# EAGLE schematic motobone2 (EAGLE 6.4)
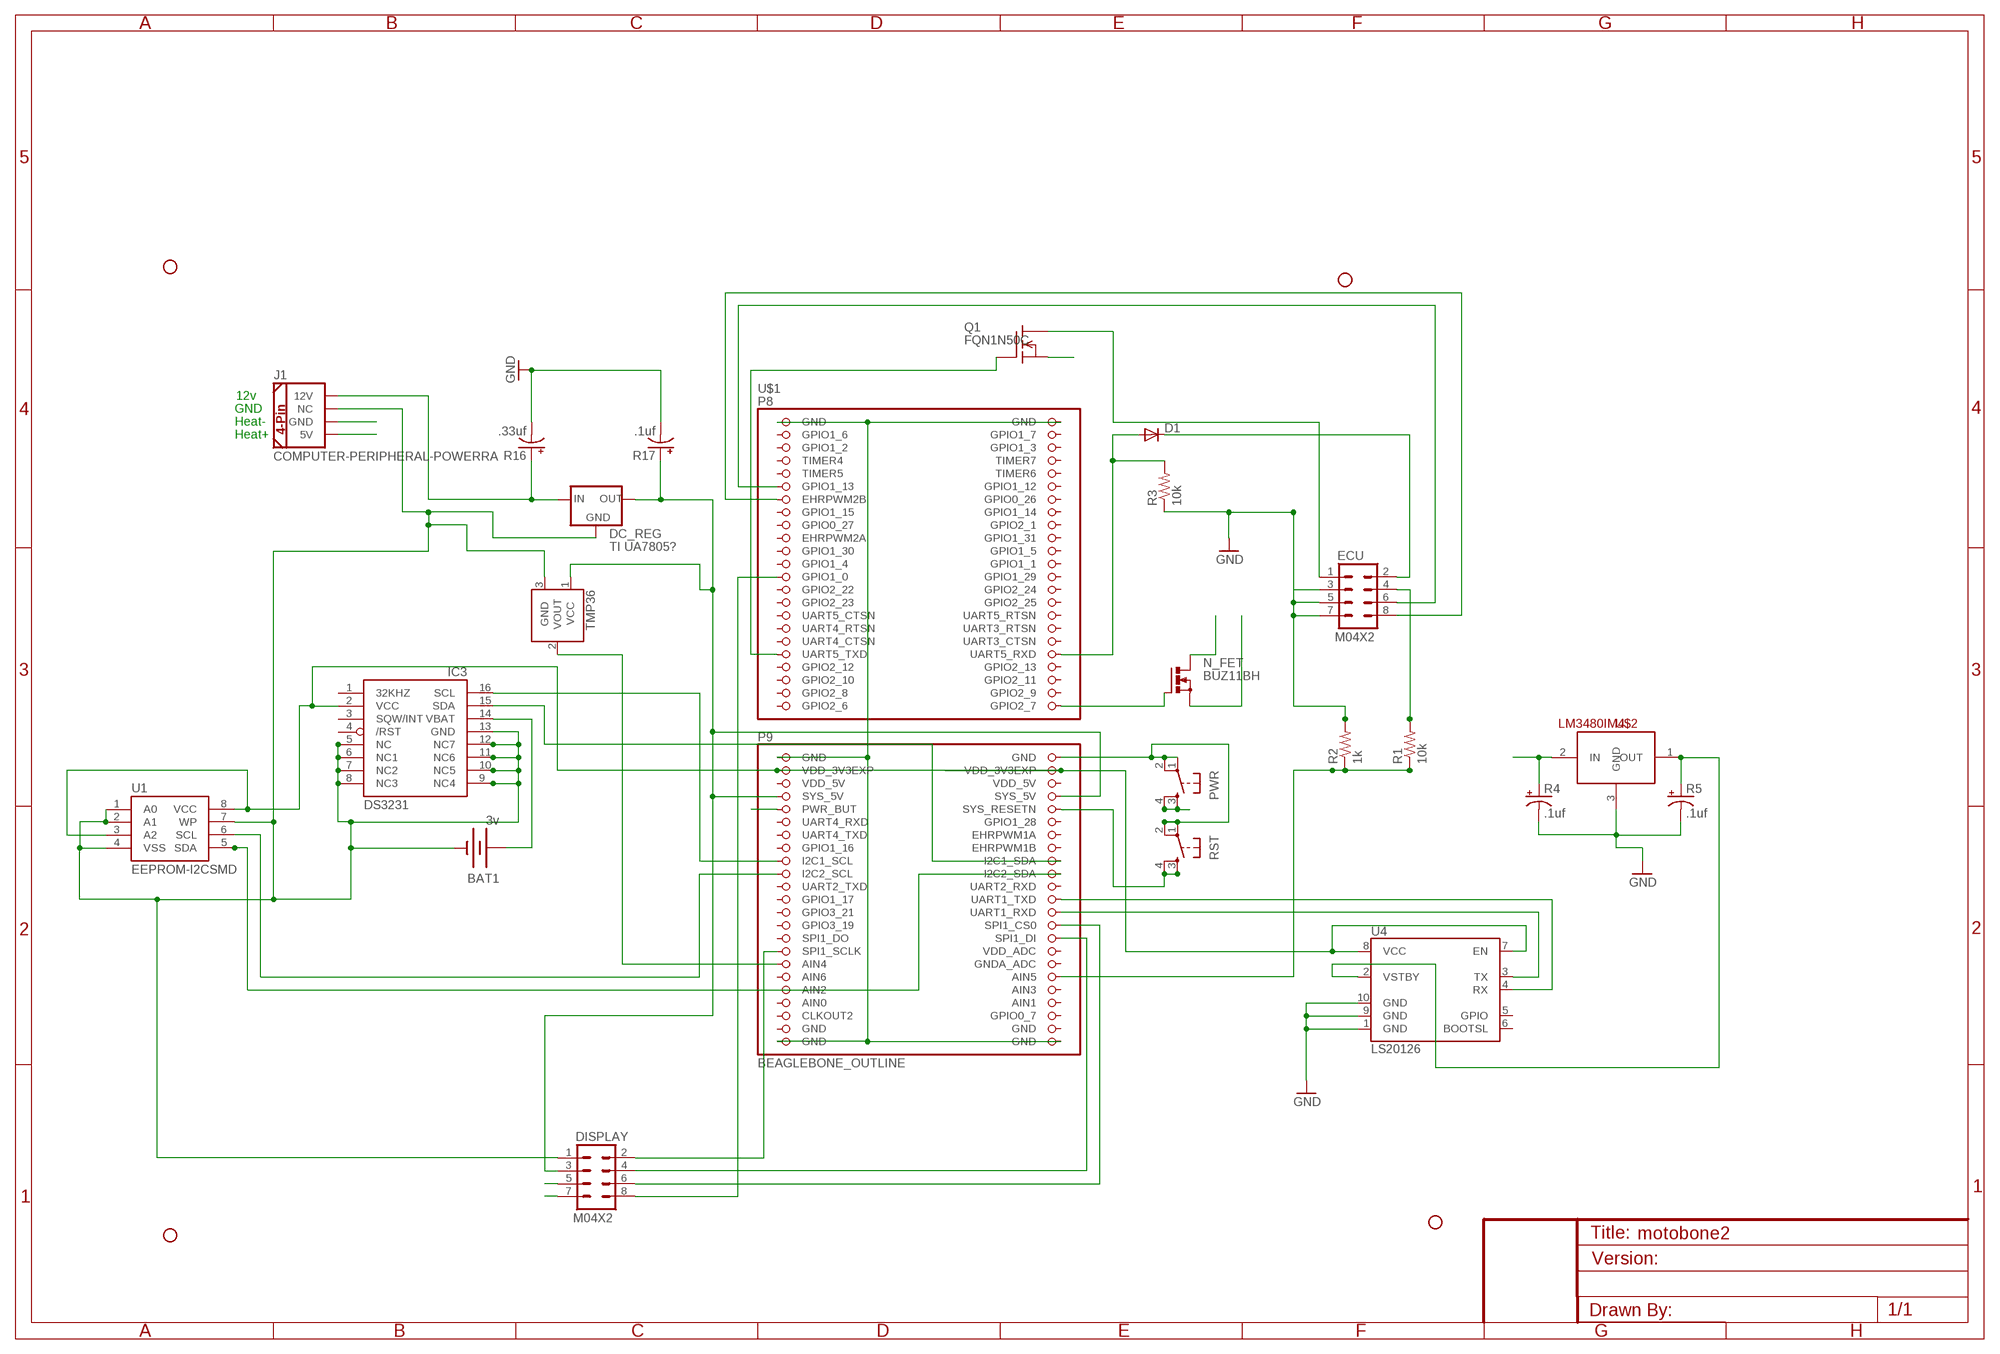
[diagram p0: schematic, sheet 1]

## Parts
BAT1  3v  BATTERY12PTH  [BATTCON_12MM_PTH]
D1  DIODE1N4148  [DIODE-1N4148]
DC_REG  TI UA7805?  V_REG_78XXSIDE  [78XXL]
DISPLAY  M04X2  [2X4]
ECU  M04X2  [2X4]
IC3  DS3231/SO  [SO16W]
J1  COMPUTER-PERIPHERAL-POWERRA  [COMPUTER-PERIPHERAL-POWER-RA]
N_FET  BUZ11BH  [TO220BH]
PWR  TAC_SWITCHPTH  [TACTILE-PTH]
Q1  FQN1N50C  [TO92]
R1  10k  RESISTOR1206  [1206]
R2  1k  RESISTOR1206  [1206]
R3  10k  RESISTOR1206  [1206]
R4  .1uf  10UF-TANT  [EIA3216]
R5  .1uf  10UF-TANT  [EIA3216]
R16  .33uf  10UF-TANT  [EIA3216]
R17  .1uf  10UF-TANT  [EIA3216]
RST  TAC_SWITCHPTH  [TACTILE-PTH]
STANDOFF1  STAND-OFF  [STAND-OFF]
STANDOFF2  STAND-OFF  [STAND-OFF]
STANDOFF3  STAND-OFF  [STAND-OFF]
STANDOFF4  STAND-OFF  [STAND-OFF]
TMP36  TMP36GT9  [TO-92]
U1  EEPROM-I2CSMD  [SO08]
U4  LS20126  [LS20126]
U$1  BEAGLEBONE_OUTLINE  [BEAGLEBONE_SHIELD]
U$2  LM3480IM4  [SOT23-3]

## Nets
12V [12v_power]: DC_REG.IN J1.12V R4.A(+) R16.A(+) U$2.2(IN)
12V_ECU: ECU.4 R1.2
GND [GND]: BAT1.GND(-) DC_REG.GND DISPLAY.1 ECU.3 ECU.5 ECU.7 IC3.5(NC) IC3.6(NC1) IC3.7(NC2) IC3.8(NC3) IC3.9(NC4) IC3.10(NC5) IC3.11(NC6) IC3.12(NC7) IC3.13(GND) J1.NC PWR.1 PWR.2 R2.2 R3.1 R4.C(-) R5.C(-) R16.C(-) R17.C(-) RST.1 RST.2 TMP36.3(GND) U1.1(A0) U1.2(A1) U1.4(VSS) U1.7(WP) U4.1(GND) U4.9(GND) U4.10(GND) U$1.1(GND) U$1.2(GND) U$1.47(GND) U$1.48(GND) U$1.91(GND) U$1.92(GND) U$2.3(GND)
HEAT+ [Heat]: J1.5V N_FET.S
HEAT- [Heat]: J1.GND N_FET.D
HEAT_GPIO: N_FET.G U$1.46(GPIO2_7)
N$1: DISPLAY.4 U$1.76(SPI1_DI)
N$2: IC3.16(SCL) U$1.63(I2C1_SCL)
N$3: DISPLAY.2 U$1.77(SPI1_SCLK)
N$4: TMP36.2(VOUT) U$1.79(AIN4)
N$5: BAT1.VCC@1(+) IC3.14(VBAT)
N$6: R5.A(+) U4.2(VSTBY) U$2.1(OUT)
N$7: IC3.15(SDA) U$1.64(I2C1_SDA)
N$9: U1.6(SCL) U$1.65(I2C2_SCL)
N$10: U1.5(SDA) U$1.66(I2C2_SDA)
N$11: DISPLAY.6 U$1.74(SPI1_CS0)
N$12: Q1.1(G) U$1.37(UART5_TXD)
N$13: ECU.6 U$1.11(GPIO1_13)
N$14: ECU.8 U$1.13(EHRPWM2B)
N$16: U4.3(TX) U$1.72(UART1_RXD)
N$17: R1.1 R2.1 U$1.82(AIN5)
N$18: U4.4(RX) U$1.70(UART1_TXD)
N$22: DISPLAY.8 U$1.25(GPIO1_0)
N$24: D1.C ECU.2
N$25: D1.A R3.2 U$1.38(UART5_RXD)
N$26: ECU.1 Q1.2(D)
PWR_BTN: DISPLAY.7 PWR.3 PWR.4 U$1.55(PWR_BUT)
RST_BTN: DISPLAY.5 RST.3 RST.4 U$1.56(SYS_RESETN)
SYS_5V [5v_power]: DC_REG.OUT DISPLAY.3 Q1.3(S) R17.A(+) TMP36.1(VCC) U$1.53(SYS_5V) U$1.54(SYS_5V)
VDD_3V3: IC3.2(VCC) U1.3(A2) U1.8(VCC) U4.7(EN) U4.8(VCC) U$1.49(VDD_3V3EXP) U$1.50(VDD_3V3EXP)
Unconnected: IC3.1(32KHZ) IC3.3(SQW/INT) IC3.4(/RST) U4.5(GPIO) U4.6(BOOTSL) U$1.3(GPIO1_6) U$1.4(GPIO1_7) U$1.5(GPIO1_2) U$1.6(GPIO1_3) U$1.7(TIMER4) U$1.8(TIMER7) U$1.9(TIMER5) U$1.10(TIMER6) U$1.12(GPIO1_12) U$1.14(GPIO0_26) U$1.15(GPIO1_15) U$1.16(GPIO1_14) U$1.17(GPIO0_27) U$1.18(GPIO2_1) U$1.19(EHRPWM2A) U$1.20(GPIO1_31) U$1.21(GPIO1_30) U$1.22(GPIO1_5) U$1.23(GPIO1_4) U$1.24(GPIO1_1) U$1.26(GPIO1_29) U$1.27(GPIO2_22) U$1.28(GPIO2_24) U$1.29(GPIO2_23) U$1.30(GPIO2_25) U$1.31(UART5_CTSN) U$1.32(UART5_RTSN) U$1.33(UART4_RTSN) U$1.34(UART3_RTSN) U$1.35(UART4_CTSN) U$1.36(UART3_CTSN) U$1.39(GPIO2_12) U$1.40(GPIO2_13) U$1.41(GPIO2_10) U$1.42(GPIO2_11) U$1.43(GPIO2_8) U$1.44(GPIO2_9) U$1.45(GPIO2_6) U$1.57(UART4_RXD) U$1.58(GPIO1_28) U$1.59(UART4_TXD) U$1.60(EHRPWM1A) U$1.61(GPIO1_16) U$1.62(EHRPWM1B) U$1.67(UART2_TXD) U$1.68(UART2_RXD) U$1.69(GPIO1_17) U$1.71(GPIO3_21) U$1.73(GPIO3_19) U$1.75(SPI1_DO) U$1.78(VDD_ADC) U$1.80(GNDA_ADC) U$1.81(AIN6) U$1.83(AIN2) U$1.84(AIN3) U$1.86(AIN1) U$1.87(CLKOUT2) U$1.88(GPIO0_7)

## Notes on the sheet
- 12v
- GND
- Heat-
- Heat+

## Power pins joined to a net without a drawn wire
AIN0: U$1.85(AIN0)
GND: U$1.89(GND) U$1.90(GND)
VDD_5V: U$1.51(VDD_5V) U$1.52(VDD_5V)

## Library data of the parts
BAT1 = SparkFun-Electromechanical:BATTERY: Battery Holders Various common sizes : AA, AAA, 20mm coin cell and 12mm coin cell. 20MM_4LEGS, BATT-10373
D1 = SparkFun-DiscreteSemi:DIODE: Diode These are standard reverse protection diodes and small signal diodes. SMA package can handle up to about 1A. SOD-323 can handle about 200mA. What the SOD-323 package when ordering, there are some mfgs out there that are 5-pin packages.
DC_REG = SparkFun-PowerIC:V_REG_78XX: Voltage Regulator Standard 7805 5V regulator. IGO (Input Ground Output). Spark Fun Electronics SKU : COM-00107
DISPLAY ECU = SparkFun-Connectors:M04X2: .1" header, two rows of four.
IC3 = adafruit:DS3231
J1 = SparkFun-Connectors:COMPUTER-PERIPHERAL-POWER
N_FET = transistor-power:BUZ11: N-CHANNEL MOS FET
PWR RST = SparkFun-Electromechanical:TAC_SWITCH: Momentary Switch Button commonly used for reset or general input. Spark Fun Electronics SKU : COM-00097 SMT- SWCH-08247
Q1 = adafruit:FQN1N50C: N-Channel Enhancement MOSFET 500V, 0.4A, 6.0 Ohm
R1-R3 = SparkFun-Resistors:RESISTOR: Resistor Basic schematic elements and footprints for 0603, 1206, and PTH resistors.
R4 R5 R16 R17 = SparkFun-Capacitors:10UF-TANT: 10uF Tantalum SMT CAP-00811- 16V 10% (EIA-3216); PROD_ID: CAP-00811; VALUE: 10uF
STANDOFF1-STANDOFF4 = SparkFun-Electromechanical:STAND-OFF: #4 Stand Off This is the mechanical footprint for a #4 phillips button head screw. Use the keepout ring to avoid running the screw head into surrounding components. SKU : PRT-00447
TMP36 = SparkFun-Sensors:TMP36: Precision degC temp sensor, analog out
U1 = SparkFun-DigitalIC:EEPROM-I2C: I2C EEPROM chips, 24LC256 (and others)
U4 = SparkFun-RF:LS20126: LS20126 20-Channel GPS Module SparkFun SKU# GPS-09838 The LOCOSYS LS20126 GPS smart antenna module is a high sensitivity, low power, SMD type, 20 channels with built-in magnetic sensor, 3-axial acceleration sensor L1 GPS receiver and 10mm patch antenna designed for portable applications.
U$1 = adafruit:BEAGLEBONE_OUTLINE: Should match A3 pinout - but not completely tested
U$2 = SparkFun-PowerIC:LM3480IM4: Small package linear regulator

## Net classes
0 default: width 0.254 mm, drill 0.254 mm, clearance 0.254 mm
1 12v_power: width 0.762 mm, drill 0.254 mm, clearance 0.254 mm
2 5v_power: width 0.762 mm, drill 0.254 mm, clearance 0.254 mm
3 GND: width 0.762 mm, drill 0.254 mm, clearance 0.254 mm
4 Heat: width 2.54 mm, drill 0.254 mm, clearance 0.254 mm